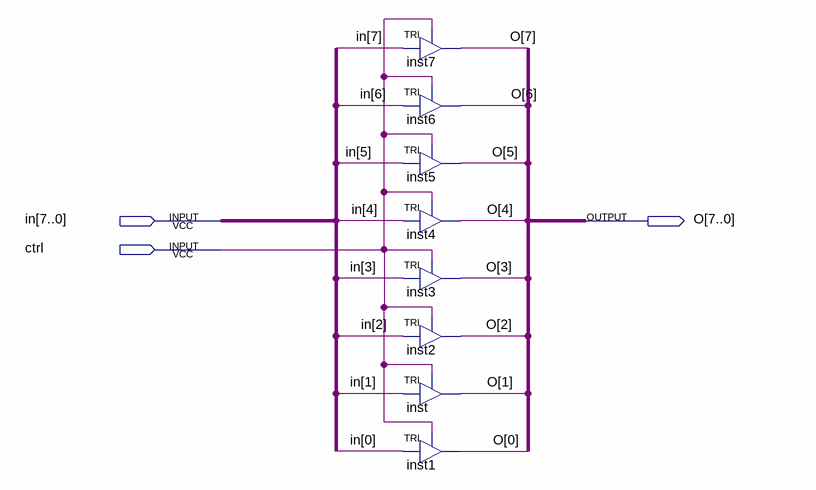
[diagram p0: schematic sheet]
// Quartus schematic TSBA.bdf as structural Verilog: 8 symbols, 3 pins
module TSBA (
  input  [7:0] in,
  input  ctrl,
  output [7:0] O
);

  TRI inst7 (.IN(in[7]), .OE(ctrl), .OUT(O[7]));
  TRI inst6 (.IN(in[6]), .OE(ctrl), .OUT(O[6]));
  TRI inst5 (.IN(in[5]), .OE(ctrl), .OUT(O[5]));
  TRI inst4 (.IN(in[4]), .OE(ctrl), .OUT(O[4]));
  TRI inst3 (.IN(in[3]), .OE(ctrl), .OUT(O[3]));
  TRI inst2 (.IN(in[2]), .OE(ctrl), .OUT(O[2]));
  TRI inst (.IN(in[1]), .OE(ctrl), .OUT(O[1]));
  TRI inst1 (.IN(in[0]), .OE(ctrl), .OUT(O[0]));
endmodule
